# EAGLE design main (EAGLE 9.2.2)

## Sheet 1 of 2
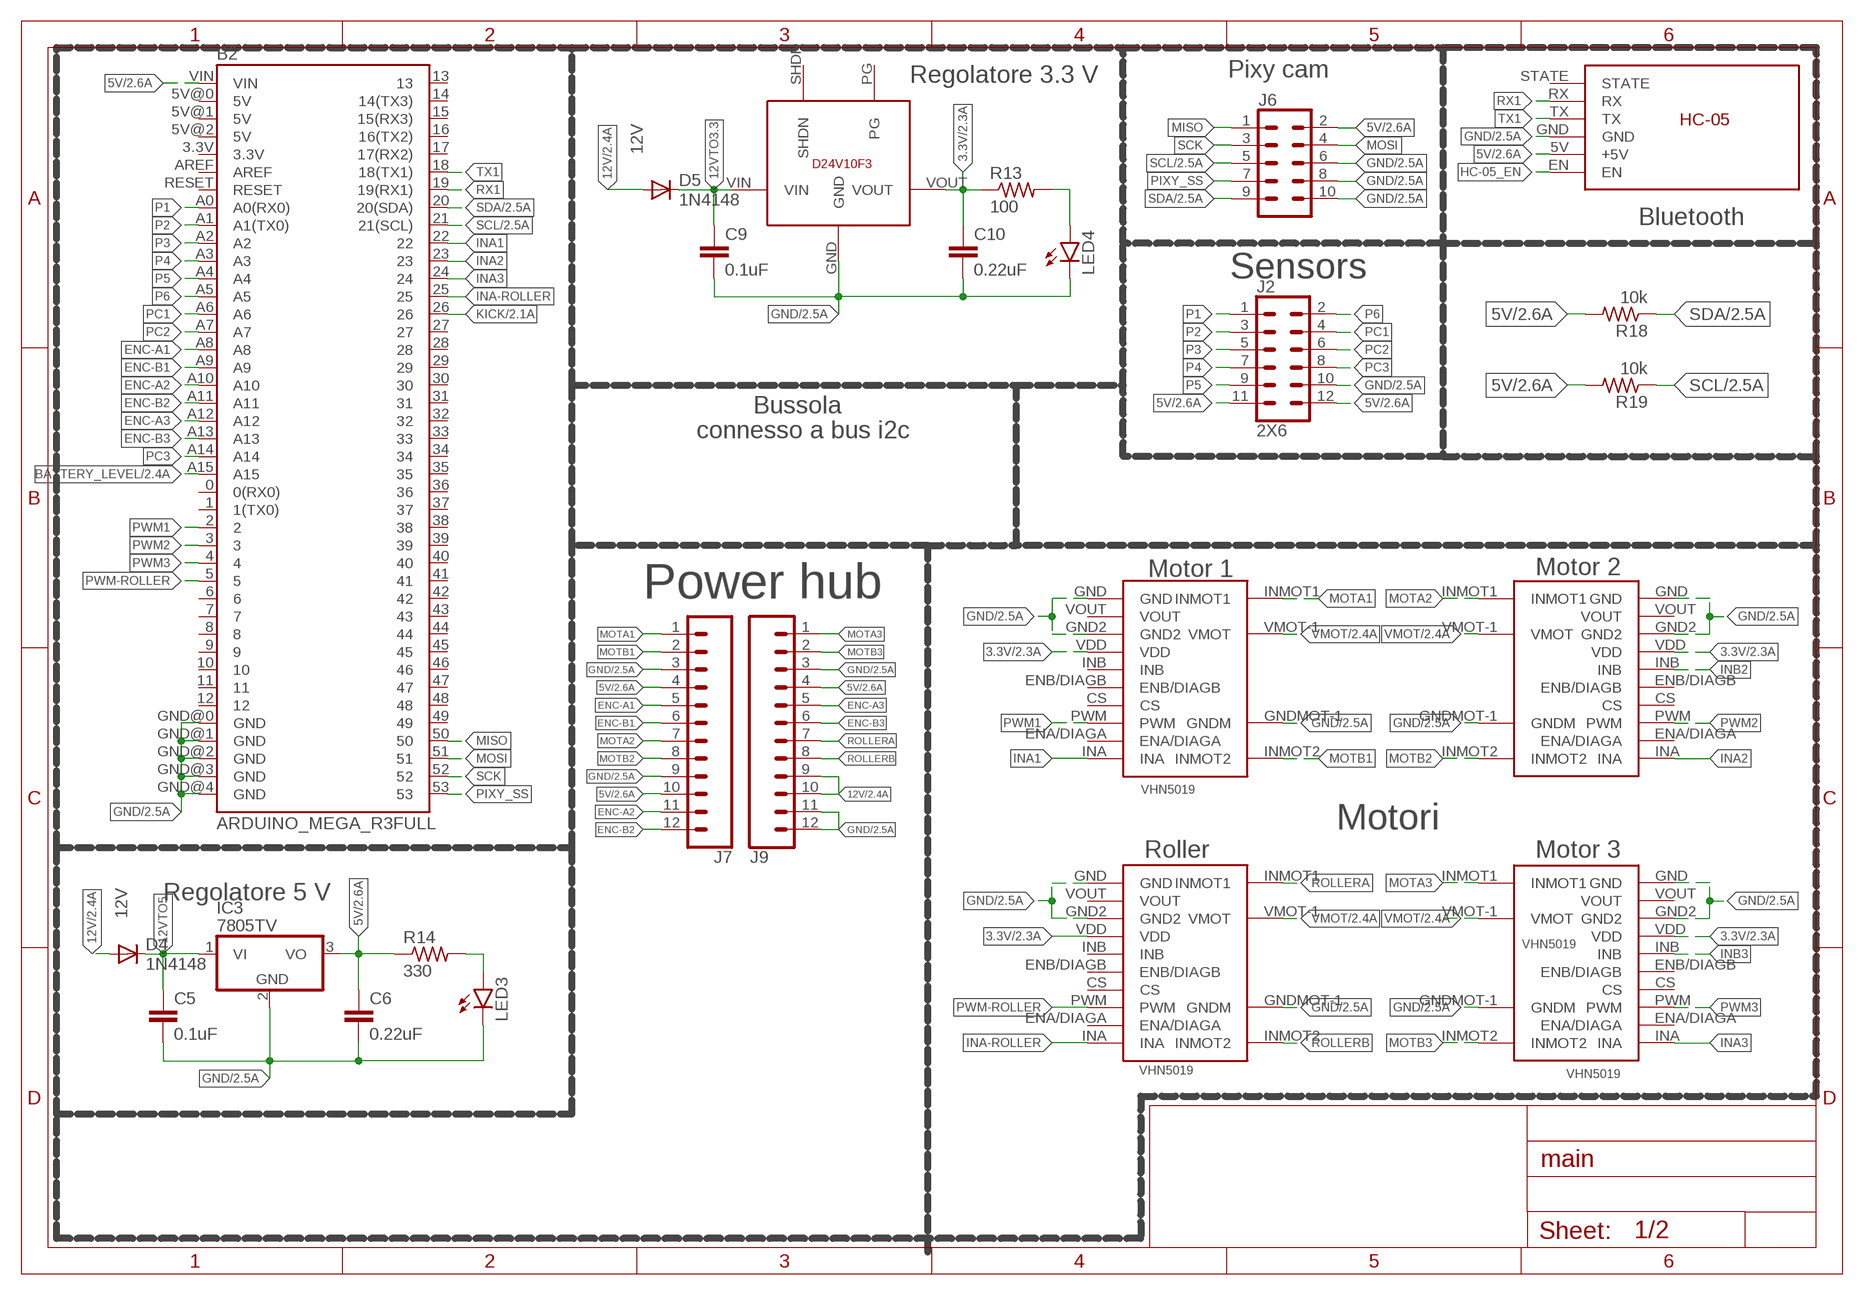
[diagram p0: schematic, sheet 1]

### Parts
B2  ARDUINO_MEGA_R3FULL  [ARDUINO_MEGA]
C5  0.1uF  0.1UF-KIT-EZ-50V-20%  [CAP-PTH-SMALL-KIT]
C6  0.22uF  0.1UF-KIT-EZ-50V-20%  [CAP-PTH-SMALL-KIT]
C9  0.1uF  0.1UF-KIT-EZ-50V-20%  [CAP-PTH-SMALL-KIT]
C10  0.22uF  0.1UF-KIT-EZ-50V-20%  [CAP-PTH-SMALL-KIT]
D4  1N4148  1N4148DO35-7  [DO35-7]
D5  1N4148  1N4148DO35-7  [DO35-7]
IC3  7805TV  [TO220V]
J2  2X6  CONN_06X2PTH_FEMALE  [2X6]
J6  CONN_05X2PTH  [2X5]
J7  CONN_12  [1X12]
J9  CONN_12  [1X12]
LED3  GREEN  LED-GREEN1206  [LED-1206]
LED4  GREEN  LED-GREEN1206  [LED-1206]
R13  100  R-US_M1206  [M1206]
R14  330  R-US_M1206  [M1206]
R18  10k  R-US_M1206  [M1206]
R19  10k  R-US_M1206  [M1206]
U$4  VHN5019  [MOTOR-SHIELD]
U$5  VHN5019  [MOTOR-SHIELD]
U$6  VHN5019  [MOTOR-SHIELD]
U$7  VHN5019  [MOTOR-SHIELD]
U$18  HC-05  [HC-05]
U$19  STEPDOWN_D24V10F3  [STEPDOWN_D24V10F3]

### Nets
3.3V [3v]: C10.1 R13.1 U$4.VDD U$5.VDD U$6.VDD U$7.VDD U$19.VOUT ; also sheet 2
5V [5v]: B2.VIN C6.1 IC3.3(VO) J2.11 J2.12 J6.2 J7.4 J7.10 J9.4 R14.1 R18.2 R19.2 U$18.5V(+5V) ; also sheet 2
12V [12v]: D4.A D5.A J9.9 J9.10 ; also sheet 2
12VTO3.3 [12v]: C9.1 D5.C U$19.VIN
12VTO5 [12v]: C5.1 D4.C IC3.1(VI)
BATTERY_LEVEL: B2.A15 ; also sheet 2
ENC-A1: B2.A8 J7.5
ENC-A2: B2.A10 J7.11
ENC-A3: B2.A12 J9.5
ENC-B1: B2.A9 J7.6
ENC-B2: B2.A11 J7.12
ENC-B3: B2.A13 J9.6
GND [gnd]: B2.GND@0(GND) B2.GND@1(GND) B2.GND@2(GND) B2.GND@3(GND) B2.GND@4(GND) C5.2 C6.2 C9.2 C10.2 IC3.2(GND) J2.10 J6.6 J6.8 J6.10 J7.3 J7.9 J9.3 J9.11 J9.12 LED3.C LED4.C U$4.GND U$4.GND2 U$4.GNDMOT-1(GNDM) U$5.GND U$5.GND2 U$5.GNDMOT-1(GNDM) U$6.GND U$6.GND2 U$6.GNDMOT-1(GNDM) U$7.GND U$7.GND2 U$7.GNDMOT-1(GNDM) U$18.GND U$19.GND ; also sheet 2
HC-05_EN: U$18.EN
INA1: B2.22 U$4.INA
INA2: B2.23 U$5.INA
INA3: B2.24 U$6.INA
INA-ROLLER: B2.25 U$7.INA
INB2: U$5.INB
INB3: U$6.INB
KICK [5v]: B2.26 ; also sheet 2
MISO: B2.50 J6.1
MOSI: B2.51 J6.4
MOTA1 [vmot]: J7.1 U$4.INMOT1
MOTA2 [vmot]: J7.7 U$5.INMOT1
MOTA3 [vmot]: J9.1 U$6.INMOT1
MOTB1 [vmot]: J7.2 U$4.INMOT2
MOTB2 [vmot]: J7.8 U$5.INMOT2
MOTB3 [vmot]: J9.2 U$6.INMOT2
N$1: LED3.A R14.2
N$21: LED4.A R13.2
P1: B2.A0(A0(RX0)) J2.1
P2: B2.A1(A1(TX0)) J2.3
P3: B2.A2 J2.5
P4: B2.A3 J2.7
P5: B2.A4 J2.9
P6: B2.A5 J2.2
PC1: B2.A6 J2.4
PC2: B2.A7 J2.6
PC3: B2.A14 J2.8
PIXY_SS: B2.53 J6.7
PWM1: B2.2 U$4.PWM
PWM2: B2.3 U$5.PWM
PWM3: B2.4 U$6.PWM
PWM-ROLLER: B2.5 U$7.PWM
ROLLERA [vmot]: J9.7 U$7.INMOT1
ROLLERB [vmot]: J9.8 U$7.INMOT2
RX1: B2.19(19(RX1)) U$18.RX
SCK: B2.52 J6.3
SCL: B2.21(21(SCL)) J6.5 R19.1 ; also sheet 2
SDA: B2.20(20(SDA)) J6.9 R18.1 ; also sheet 2
TX1: B2.18(18(TX1)) U$18.TX
VMOT [vmot]: U$4.VMOT-1(VMOT) U$5.VMOT-1(VMOT) U$6.VMOT-1(VMOT) U$7.VMOT-1(VMOT) ; also sheet 2
Unconnected: B2.0(0(RX0)) B2.1(1(TX0)) B2.3.3V B2.5V@0(5V) B2.5V@1(5V) B2.5V@2(5V) B2.6 B2.7 B2.8 B2.9 B2.10 B2.11 B2.12 B2.13 B2.14(14(TX3)) B2.15(15(RX3)) B2.16(16(TX2)) B2.17(17(RX2)) B2.27 B2.28 B2.29 B2.30 B2.31 B2.32 B2.33 B2.34 B2.35 B2.36 B2.37 B2.38 B2.39 B2.40 B2.41 B2.42 B2.43 B2.44 B2.45 B2.46 B2.47 B2.48 B2.49 B2.AREF B2.RESET U$4.CS U$4.ENA/DIAGA U$4.ENB/DIAGB U$4.INB U$4.VOUT U$5.CS U$5.ENA/DIAGA U$5.ENB/DIAGB U$5.VOUT U$6.CS U$6.ENA/DIAGA U$6.ENB/DIAGB U$6.VOUT U$7.CS U$7.ENA/DIAGA U$7.ENB/DIAGB U$7.INB U$7.VOUT U$18.STATE U$19.PG U$19.SHDN

### Notes on the sheet
- Regolatore 3.3 V | Pixy cam
- Bluetooth
- Sensors
- Bussola
- connesso a bus i2c
- Motor 1 | Motor 2
- Power hub
- Motori
- Roller | Motor 3
- Regolatore 5 V

## Sheet 2 of 2
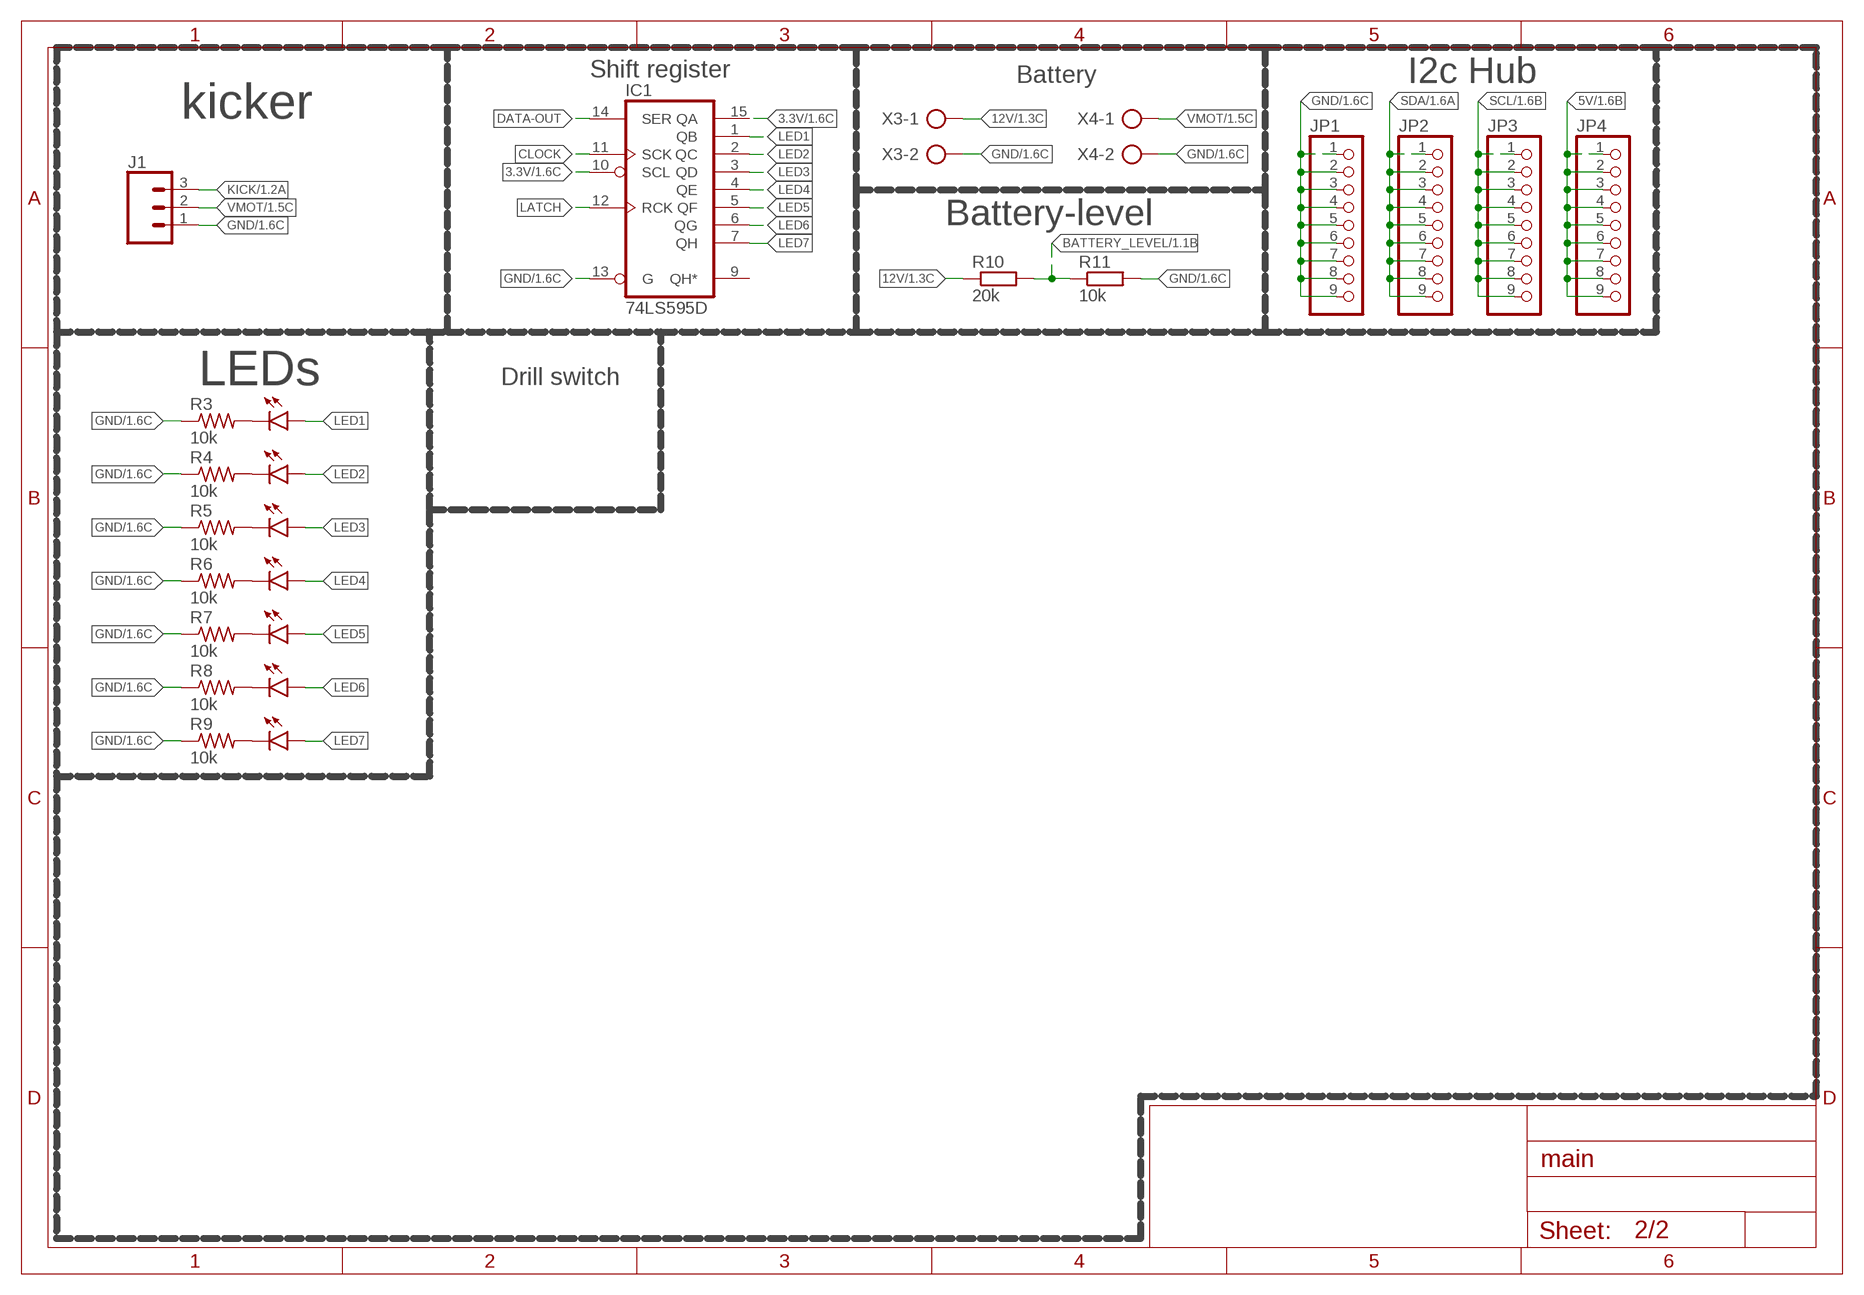
[diagram p1: schematic, sheet 2]

### Parts
D1  GREEN  LED-GREEN1206  [LED-1206]
D3  GREEN  LED-GREEN1206  [LED-1206]
D6  GREEN  LED-GREEN1206  [LED-1206]
D7  GREEN  LED-GREEN1206  [LED-1206]
D8  GREEN  LED-GREEN1206  [LED-1206]
D9  GREEN  LED-GREEN1206  [LED-1206]
D10  GREEN  LED-GREEN1206  [LED-1206]
IC1  74LS595D  [SO16]
J1  CONN_03  [1X03]
JP1  PINHD-1X9  [1X09-BIG]
JP2  PINHD-1X9  [1X09-BIG]
JP3  PINHD-1X9  [1X09-BIG]
JP4  PINHD-1X9  [1X09-BIG]
R3  10k  R-US_M1206  [M1206]
R4  10k  R-US_M1206  [M1206]
R5  10k  R-US_M1206  [M1206]
R6  10k  R-US_M1206  [M1206]
R7  10k  R-US_M1206  [M1206]
R8  10k  R-US_M1206  [M1206]
R9  10k  R-US_M1206  [M1206]
R10  20k  R0204/7  [0204/7]
R11  10k  R0204/7  [0204/7]
X3  AK500/2-H  [AK500/2-H]
X4  AK500/2-H  [AK500/2-H]

### Nets
3.3V [3v]: IC1.10(SCL) IC1.15(QA) ; also sheet 1
5V [5v]: JP4.1 JP4.2 JP4.3 JP4.4 JP4.5 JP4.6 JP4.7 JP4.8 JP4.9 ; also sheet 1
12V [12v]: R10.1 X3.1 ; also sheet 1
BATTERY_LEVEL: R10.2 R11.1 ; also sheet 1
CLOCK: IC1.11(SCK)
DATA-OUT: IC1.14(SER)
GND [gnd]: IC1.13(G) J1.1 JP1.1 JP1.2 JP1.3 JP1.4 JP1.5 JP1.6 JP1.7 JP1.8 JP1.9 R3.1 R4.1 R5.1 R6.1 R7.1 R8.1 R9.1 R11.2 X3.2 X4.2 ; also sheet 1
KICK [5v]: J1.3 ; also sheet 1
LATCH: IC1.12(RCK)
LED1: D1.A IC1.1(QB)
LED2: D3.A IC1.2(QC)
LED3: D6.A IC1.3(QD)
LED4: D7.A IC1.4(QE)
LED5: D8.A IC1.5(QF)
LED6: D9.A IC1.6(QG)
LED7: D10.A IC1.7(QH)
N$2: D1.C R3.2
N$3: D3.C R4.2
N$4: D6.C R5.2
N$5: D7.C R6.2
N$6: D8.C R7.2
N$7: D9.C R8.2
N$8: D10.C R9.2
SCL: JP3.1 JP3.2 JP3.3 JP3.4 JP3.5 JP3.6 JP3.7 JP3.8 JP3.9 ; also sheet 1
SDA: JP2.1 JP2.2 JP2.3 JP2.4 JP2.5 JP2.6 JP2.7 JP2.8 JP2.9 ; also sheet 1
VMOT [vmot]: J1.2 X4.1 ; also sheet 1
Unconnected: IC1.9(QH*)

### Notes on the sheet
- Shift register | Battery | I2c Hub
- kicker
- Battery-level
- LEDs | Drill switch

## Power pins joined to a net without a drawn wire
GND: IC1.8(GND)
VCC: IC1.16(VCC)

## Library data of the parts
B2 = SparkFun-Boards:ARDUINO_MEGA_R3: Arduino Mega R3 ATmega2560 R3 compatible footprint. SparkFun Products: Arduino Mega 2560 R3 <https://www.sparkfun.com/products/11061>
C5 C9 = SparkFun-Capacitors:0.1UF: 0.1µF ceramic capacitors A capacitor is a passive two-terminal electrical component used to store electrical energy temporarily in an electric field.; PROD_ID: CAP-08370
C6 C10 = SparkFun-Capacitors:0.1UF: 0.1µF ceramic capacitors A capacitor is a passive two-terminal electrical component used to store electrical energy temporarily in an electric field.; PROD_ID: CAP-08370; VALUE: 0.1uF
D1 D3 D6-D10 LED3 LED4 = SparkFun-LED:LED-GREEN: Green SMD LED Used in manufacturing of various products at SparkFun Packages: 0603 - SMD 0603 package [Product Link] <http://www.futureelectronics.com/en/technologies/semiconductors/optoelectronics/leds/Pages/9894312-LTST-C190GKT.aspx?CrossPart=HSMG-C190&IM=0> LilyPad 1206 - SMD1206 LilyPad package [Product Link] <http://www.futureelectronics.com/en/Technologies/Product.aspx?ProductID=IN150NGHARVATEKCORPORATION2049943&IM=0> 1206 - SMD1206 package [Product Link] <http://www.futureelectronics.com/en/technologies/semiconductors/optoelectronics/leds/Pages/8315665-LTST-C150KGKT.aspx?IM=0> 1206 Bottom Mount -SMD 1206 Bottom Mount [Product Link] <http://www.digikey.com/product-detail/en/lite-on-inc/LTST-C230KGKT/160-1456-1-ND/386854> SparkFun Products: Pro Mini 328 -5V <https://www.sparkfun.com/products/821> RedBoard <https://www.sparkfun.com/products/12757> MP3 Trigger <https://www.sparkfun.com/products/13720> Makey Makey <https://www.sparkfun.com/products/11076>; PROD_ID: DIO-00862
D4 D5 = diode:1N4148: DIODE high speed (Philips)
IC1 = 74xx-us:74*595: 8-bit SHIFT REGISTER, output latch
IC3 = linear:78*: Positive VOLTAGE REGULATOR Source: http://cache.national.com/ds/LM/LM78L05.pdf http://www.fairchildsemi.com/ds/LM/LM7805.pdf
J1 = SparkFun-Connectors:CONN_03: Multi connection point. Often used as Generic Header-pin footprint for 0.1 inch spaced/style header connections On any of the 0.1 inch spaced packages, you can populate with these: Break Away Headers - Straight <https://www.sparkfun.com/products/116> (PRT-00116) Break Away Male Headers - Right Angle <https://www.sparkfun.com/products/553> (PRT-00553) Female Headers <https://www.sparkfun.com/products/115> (PRT-00115) Break Away Headers - Machine Pin <https://www.sparkfun.com/products/117> (PRT-00117) Break Away Female Headers - Swiss Machine Pin <https://www.sparkfun.com/products/743> (PRT-00743) Stackable Header - 3 Pin (Female, 0.1") <https://www.sparkfun.com/products/13875> (PRT-13875) For SCREWTERMINALS and SPRING TERMINALS visit here: Screw Terimnals on SparkFun.com <https://www.sparkfun.com/search/results?term=Screw+Terminals> (5mm/3.5mm/2.54mm spacing) This device is also useful as a general connection point to wire up your design to another part of your project. Our various solder wires solder well into these plated through hole pads. Hook-Up Wire - Assortment (Stranded, 22 AWG) <https://www.sparkfun.com/products/11375> (PRT-11375) Hook-Up Wire - Assortment (Solid Core, 22 AWG) <https://www.sparkfun.com/products/11367> (PRT-11367) View the entire wire category on our website here <https://www.sparkfun.com/categories/141> Special notes: Molex polarized connector foot print use with SKU : PRT-08232 with associated crimp pins and housings.
J2 = SparkFun-Connectors:CONN_06X2: Multi connection point. Often used as Generic Header-pin footprint for 0.1 inch spaced/style header connections On any of the 0.1 inch spaced packages, you can populate with these: Break Away Headers - Straight <https://www.sparkfun.com/products/116> (PRT-00116) Break Away Male Headers - Right Angle <https://www.sparkfun.com/products/553> (PRT-00553) Female Headers <https://www.sparkfun.com/products/115> (PRT-00115) Break Away Headers - Machine Pin <https://www.sparkfun.com/products/117> (PRT-00117) Break Away Female Headers - Swiss Machine Pin <https://www.sparkfun.com/products/743> (PRT-00743); PROD_ID: CONN-12423; VALUE: 2X6 FEMALE
J6 = SparkFun-Connectors:CONN_05X2: Multi connection point. Often used as Generic Header-pin footprint for 0.1 inch spaced/style header connections For AVR SPI programming port, see special device with nice symbol: "AVR_SPI_PROG_5x2.dev" You can populate with any combo of single row headers, but if you'd like an exact match, check these: 2x5 AVR ICSP Male Header <https://www.sparkfun.com/products/778> (PRT-00778) 2x5 Pin Shrouded Header <https://www.sparkfun.com/products/8506> (PRT-08506) On any of the 0.1 inch spaced packages, you can populate with these: Break Away Headers - Straight <https://www.sparkfun.com/products/116> (PRT-00116) Break Away Male Headers - Right Angle <https://www.sparkfun.com/products/553> (PRT-00553) Female Headers <https://www.sparkfun.com/products/115> (PRT-00115) Break Away Headers - Machine Pin <https://www.sparkfun.com/products/117> (PRT-00117) Break Away Female Headers - Swiss Machine Pin <https://www.sparkfun.com/products/743> (PRT-00743) Special note: the shrouded connector mates well with our 5x2 ribbon cables: 2x5 Pin IDC Ribbon Cable <https://www.sparkfun.com/products/8535> (PRT-08535); PROD_ID: CONN-08499; SF_ID: PRT-0778
J7 J9 = SparkFun-Connectors:CONN_12: Multi connection point. Often used as Generic Header-pin footprint for 0.1 inch spaced/style header connections On any of the 0.1 inch spaced packages, you can populate with these: Break Away Headers - Straight <https://www.sparkfun.com/products/116> (PRT-00116) Break Away Male Headers - Right Angle <https://www.sparkfun.com/products/553> (PRT-00553) Female Headers <https://www.sparkfun.com/products/115> (PRT-00115) Break Away Headers - Machine Pin <https://www.sparkfun.com/products/117> (PRT-00117) Break Away Female Headers - Swiss Machine Pin <https://www.sparkfun.com/products/743> (PRT-00743) For SCREWTERMINALS and SPRING TERMINALS visit here: Screw Terimnals on SparkFun.com <https://www.sparkfun.com/search/results?term=Screw+Terminals> (5mm/3.5mm/2.54mm spacing) This device is also useful as a general connection point to wire up your design to another part of your project. Our various solder wires solder well into these plated through hole pads. Hook-Up Wire - Assortment (Stranded, 22 AWG) <https://www.sparkfun.com/products/11375> (PRT-11375) Hook-Up Wire - Assortment (Solid Core, 22 AWG) <https://www.sparkfun.com/products/11367> (PRT-11367) View the entire wire category on our website here <https://www.sparkfun.com/categories/141> Special notes: Molex polarized connector foot print use with SKU : PRT-08231 with associated crimp pins and housings. 1MM SMD Version SKU: PRT-10208 NOTES ON THE VARIANTS LOCK and LOCK_LONGPADS... This footprint was designed to help hold the alignment of a through-hole component (i.e. 6-pin header) while soldering it into place. You may notice that each hole has been shifted either up or down by 0.005 of an inch from it's more standard position (which is a perfectly straight line). This slight alteration caused the pins (the squares in the middle) to touch the edges of the holes. Because they are alternating, it causes a "brace" to hold the component in place. 0.005 has proven to be the perfect amount of "off-center" position when using our standard breakaway headers. Although looks a little odd when you look at the bare footprint, once you have a header in there, the alteration is very hard to notice. Also,if you push a header all the way into place, it is covered up entirely on the bottom side.
JP1-JP4 = adafruit:PINHD-1X9: Pin header 1x10 0.1" spacing With round pins
R3-R9 R13 R14 R18 R19 = resistor:R-US_: RESISTOR, American symbol
R10 R11 = eagle-ltspice:R: RESISTOR, European symbol; SPICEMODEL: NONE; SPICEPREFIX: R
U$4-U$7 = VHN5019:VHN5019: Operating voltage: 5.5 – 24 V1 Output current: 12 A continuous (30 maximum) 3V-compatible inputs PWM operation up to 20 kHz, which is ultrasonic and allows for quieter motor operation Current sense output proportional to motor current (approx. 140 mV/A) Motor indicator LEDs (indicates what the outputs are doing even when no motor is connected) Robust: Reverse-voltage protection Can survive input voltages up to 41 V Undervoltage and overvoltage shutdown High-side and low-side thermal shutdown Short-to-ground and short-to-Vcc protection; MOTOR: motor
U$18 = HC-05:HC-05
U$19 = StepDown_ 3.3V_D24V10F3:STEPDOWN_D24V10F3: Step down pololu D24V10F3 da 12 V a 3.3V
X3 X4 = con-ptr500:AK500/2-H: CONNECTOR Aug. 2004 / PTR Meßtechnik: Die Bezeichnung der Serie AK505 wurde geändert. Es handelt sich hierbei um AK500 in horizontaler Ausführung.; OC_FARNELL: unknown; OC_NEWARK: unknown

## Net classes
0 default: width 0.508 mm, clearance 0.152 mm
1 gnd: width 1.27 mm, clearance 0.152 mm
2 12v: width 1.524 mm, clearance 0.406 mm
3 5v: width 0.508 mm, clearance 0.305 mm
4 3v: width 0.508 mm, clearance 0.305 mm
5 vmot: width 1.27 mm, clearance 0.406 mm

## Board
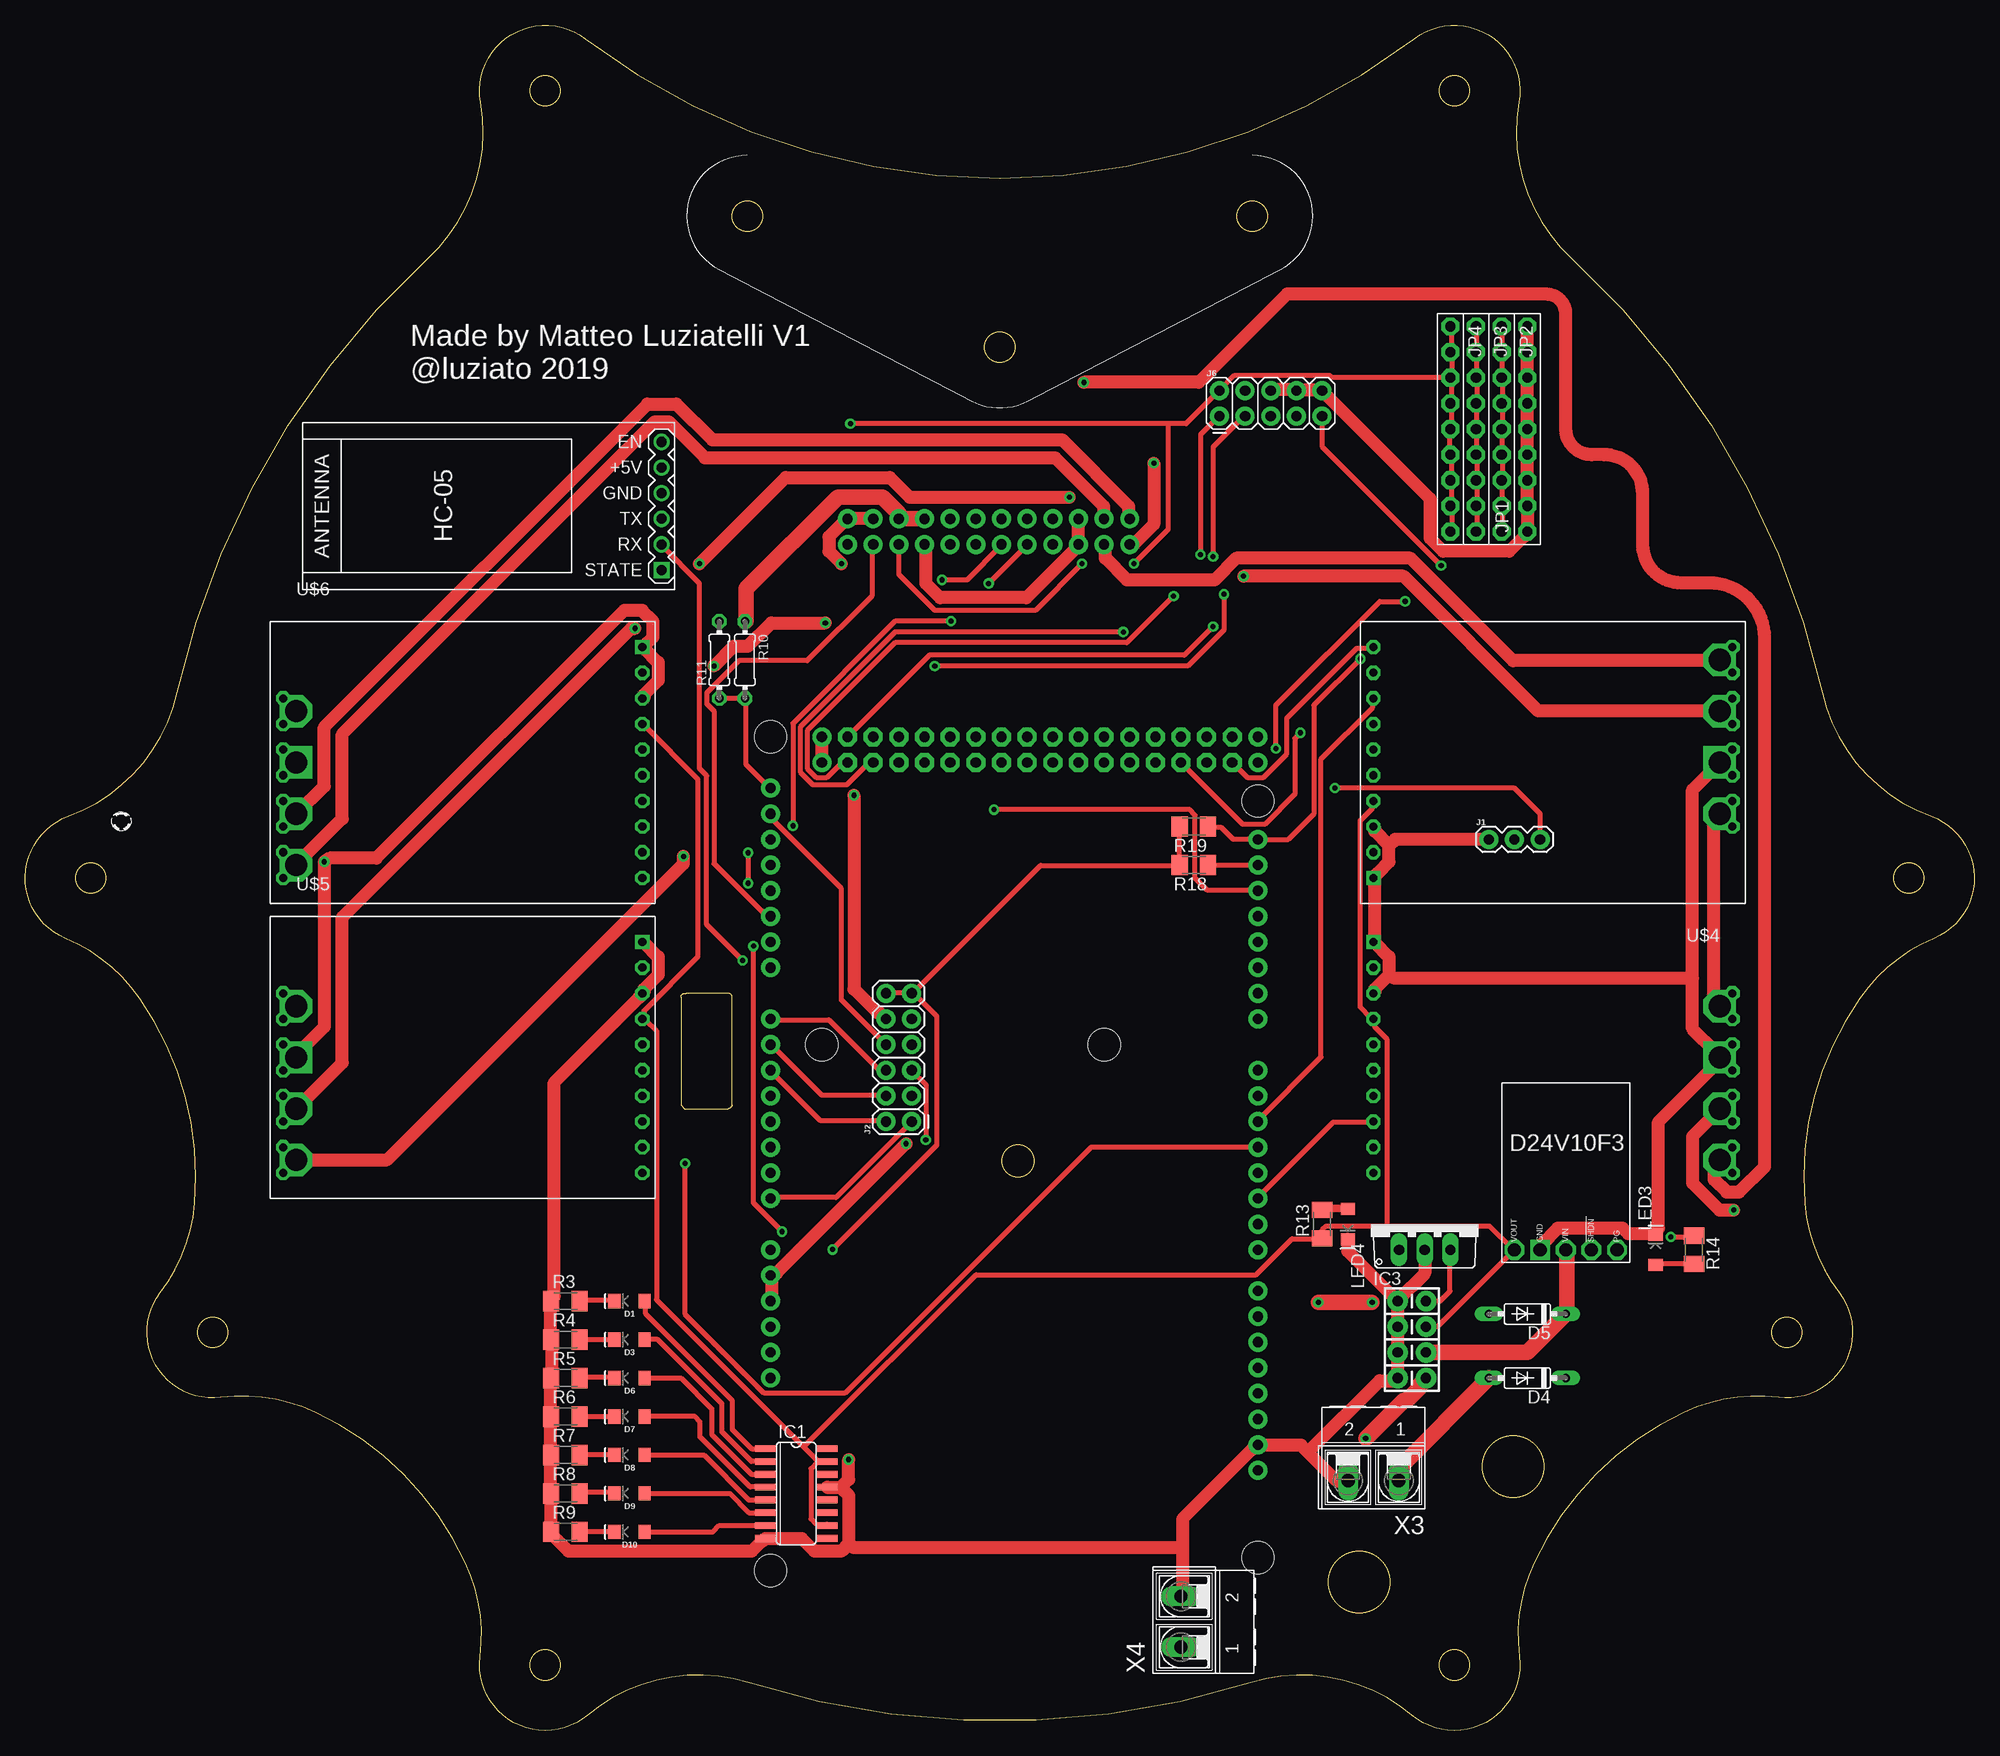
[diagram p2: board, top side]
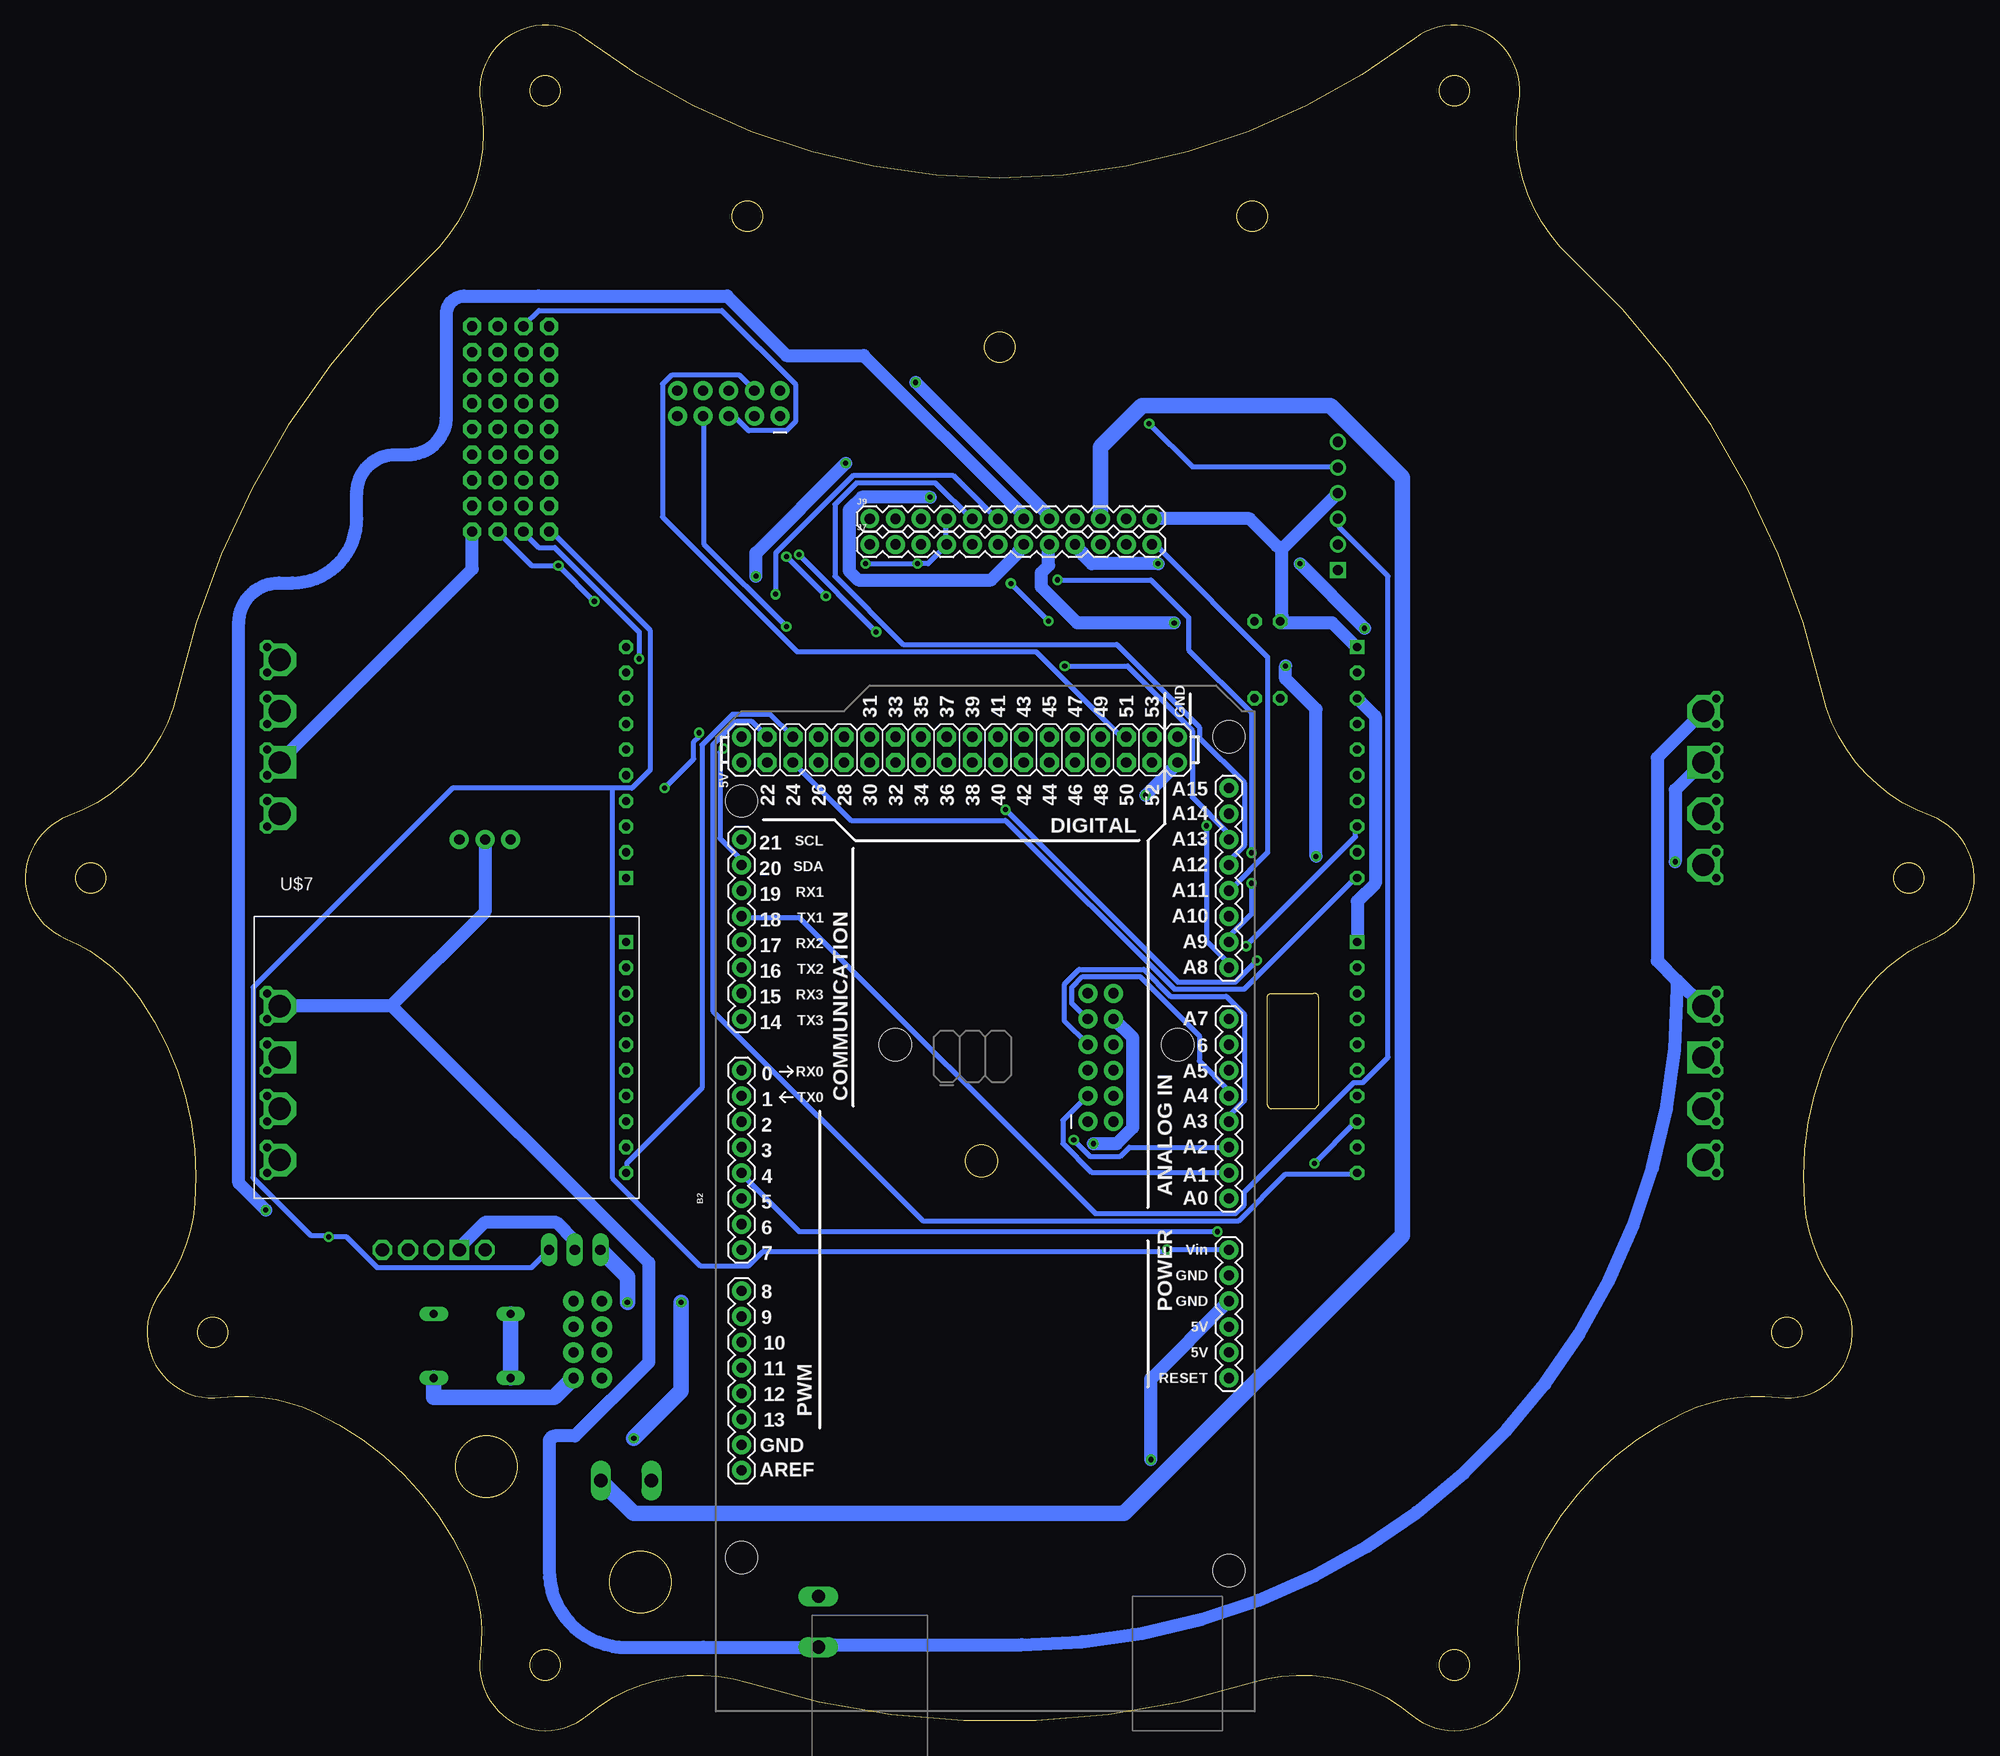
[diagram p3: board, bottom side, seen from below]

Size 193 x 168.88 mm. Coordinates in mm from the lower left corner, seen from the top.
Outline: 15.04,102.79 arc-35 39.88,145.82 arc57 45.1,161.26 arc-137 55.43,167.56 arc74 137.57,167.56 arc-137 147.9,161.26 arc57 153.12,145.82 arc-35 177.96,102.79 arc57 188.72,90.55 arc-137 189.01,78.45 arc32 181.65,72.5 arc40 176.22,52.2 arc32 179.62,43.37 arc-134 173.62,32.99 arc32 164.28,31.53 arc40 149.42,16.66 arc32 147.95,7.32 arc-137 137.32,1.52 arc57 121.34,4.72 arc-35 71.66,4.72 arc57 55.68,1.52 arc-137 45.05,7.32 arc32 43.58,16.66 arc40 28.72,31.53 arc32 19.37,32.99 arc-134 13.38,43.37 arc32 16.78,52.2 arc40 11.34,72.5 arc32 3.98,78.45 arc-137 4.27,90.55 arc57 15.04,102.79
Outline: 66.19,61.58 69.62,61.58 arc67 70,61.96 70,72.63 arc90 69.62,73.01 69.49,73.01 65.43,73.01 65.3,73.01 arc90 64.92,72.63 64.92,62.85 64.92,61.96 65.3,61.58 66.19,61.58
Outline: circle at 96.5,136.99 radius 1.5
Outline: circle at 6.5,84.44 radius 1.5
Outline: circle at 121.5,149.99 radius 1.5
Outline: circle at 18.56,39.44 radius 1.5
Outline: circle at 141.5,6.5 radius 1.5
Outline: circle at 141.5,162.38 radius 1.5
Outline: circle at 186.5,84.44 radius 1.5
Outline: circle at 51.5,162.38 radius 1.5
Outline: circle at 51.5,6.5 radius 1.5
Outline: circle at 174.44,39.44 radius 1.5
Outline: circle at 71.5,149.99 radius 1.5
Outline: circle at 147.34,26.15 radius 3.05
Outline: circle at 132.1,14.72 radius 3.05
Outline: circle at 98.31,56.43 radius 1.6
Copper layers (1*16): Top 0.035mm / dielectric 1.5mm / Bottom 0.035mm
Design rules "SparkFun": minimum track width 8mil, minimum drill 20mil, track to track 8mil, track to pad 8mil, pad to pad 8mil, via to via 8mil, smd to smd 8mil, copper to edge 10mil, drill to drill 8mil, minimum pad ring 12mil, minimum via ring 10mil, stop-mask expansion 4mil, vias tented up to drill 25mil, thermal gap 10mil

### Footprints (pad centres in the part's own frame; a part is rotated, then mirrored left to right if it is on the bottom)
ARDUINO_MEGA = drill 1.016 pad 1.88: 0 13.97,24.13; 1 11.43,24.13; 2 8.89,24.13; 3 6.35,24.13; 3.3V -13.97,-24.13; 4 3.81,24.13; 5 1.27,24.13; 5V@0 -11.43,-24.13; 5V@1 44.45,24.13; 5V@2 46.99,24.13; 6 -1.27,24.13; 7 -3.81,24.13; 8 -7.874,24.13; 9 -10.414,24.13; 10 -12.954,24.13; 11 -15.494,24.13; 12 -18.034,24.13; 13 -20.574,24.13; 14 19.05,24.13; 15 21.59,24.13; 16 24.13,24.13; 17 26.67,24.13; 18 29.21,24.13; 19 31.75,24.13; 20 34.29,24.13; 21 36.83,24.13; A0 1.27,-24.13; A1 3.81,-24.13; A2 6.35,-24.13; A3 8.89,-24.13; A4 11.43,-24.13; A5 13.97,-24.13; A6 16.51,-24.13; A7 19.05,-24.13; A8 24.13,-24.13; A9 26.67,-24.13; A10 29.21,-24.13; A11 31.75,-24.13; A12 34.29,-24.13; A13 36.83,-24.13; A14 39.37,-24.13; A15 41.91,-24.13; AREF -25.654,24.13; GND@0 -8.89,-24.13; GND@1 -6.35,-24.13; GND@2 44.45,-19.05; GND@3 46.99,-19.05; GND@4 -23.114,24.13; RESET -16.51,-24.13; VIN -3.81,-24.13 | drill 1.016 pad 1.88 octagon: 22 44.45,21.59; 23 46.99,21.59; 24 44.45,19.05; 25 46.99,19.05; 26 44.45,16.51; 27 46.99,16.51; 28 44.45,13.97; 29 46.99,13.97; 30 44.45,11.43; 31 46.99,11.43; 32 44.45,8.89; 33 46.99,8.89; 34 44.45,6.35; 35 46.99,6.35; 36 44.45,3.81; 37 46.99,3.81; 38 44.45,1.27; 39 46.99,1.27; 40 44.45,-1.27; 41 46.99,-1.27; 42 44.45,-3.81; 43 46.99,-3.81; 44 44.45,-6.35; 45 46.99,-6.35; 46 44.45,-8.89; 47 46.99,-8.89; 48 44.45,-11.43; 49 46.99,-11.43; 50 44.45,-13.97; 51 46.99,-13.97; 52 44.45,-16.51; 53 46.99,-16.51 | hole 3.2: -34.29,24.13; -35.56,-24.13; 16.51,8.89; 16.51,-19.05; 40.64,24.13; 46.99,-24.13
CAP-PTH-SMALL-KIT = drill 1.016 pad 2.032: 1 -1.397,0; 2 1.397,0
LED-1206 = smd 1.2 x 1.4: A -1.5,0; C 1.5,0
DO35-7 = drill 0.813 long: A 3.81,0; C -3.81,0
SO16 = smd 0.66 x 2.032: 1 -4.445,-3.073; 2 -3.175,-3.073; 3 -1.905,-3.073; 4 -0.635,-3.073; 5 0.635,-3.073; 6 1.905,-3.073; 7 3.175,-3.073; 8 4.445,-3.073; 9 4.445,3.073; 10 3.175,3.073; 11 1.905,3.073; 12 0.635,3.073; 13 -0.635,3.073; 14 -1.905,3.073; 15 -3.175,3.073; 16 -4.445,3.073
TO220V = drill 1.016 long: 1 -2.54,-2.54; 2 0,-2.54; 3 2.54,-2.54
1X03 = drill 1.016 pad 1.88: 1 0,0; 2 2.54,0; 3 5.08,0
2X6 = drill 1.016 pad 1.88: 1 0,0; 2 0,2.54; 3 2.54,0; 4 2.54,2.54; 5 5.08,0; 6 5.08,2.54; 7 7.62,0; 8 7.62,2.54; 9 10.16,0; 10 10.16,2.54; 11 12.7,0; 12 12.7,2.54
2X5 = drill 1.016 pad 1.88: 1 0,0; 2 0,2.54; 3 2.54,0; 4 2.54,2.54; 5 5.08,0; 6 5.08,2.54; 7 7.62,0; 8 7.62,2.54; 9 10.16,0; 10 10.16,2.54
1X12 = drill 1.016 pad 1.88: 1 0,0; 2 2.54,0; 3 5.08,0; 4 7.62,0; 5 10.16,0; 6 12.7,0; 7 15.24,0; 8 17.78,0; 9 20.32,0; 10 22.86,0; 11 25.4,0; 12 27.94,0
1X09-BIG = drill 1.016 pad 1.778 octagon: 1 -10.16,0; 2 -7.62,0; 3 -5.08,0; 4 -2.54,0; 5 0,0; 6 2.54,0; 7 5.08,0; 8 7.62,0; 9 10.16,0
M1206 = smd 1.6 x 2: 1 -1.4,0; 2 1.4,0
0204/7 = drill 0.813 octagon: 1 -3.81,0; 2 3.81,0
MOTOR-SHIELD = drill 0.8 octagon: CS 29.21,-5.08; ENA/DIAGA 29.21,-10.16; ENB/DIAGB 29.21,-2.54; GND2 29.21,5.08; GNDMOT-2 -6.35,0; GNDMOT-3 -6.35,-2.54; INA 29.21,-12.7; INB 29.21,0; OUTA-2 -6.35,-10.16; OUTA-3 -6.35,-12.7; OUTB-2 -6.35,-5.08; OUTB-3 -6.35,-7.62; PWM 29.21,-7.62; VDD 29.21,2.54; VMOT-2 -6.35,5.08; VMOT-3 -6.35,2.54; VOUT 29.21,7.62 | drill 0.8 square: GND 29.21,10.16 | drill 2.2 square: GNDMOT-1 -5.08,-1.27 | drill 2.2 octagon: INMOT1 -5.08,-6.35; INMOT2 -5.08,-11.43; VMOT-1 -5.08,3.81
HC-05 = drill 1: 5V 3.81,-19.685; EN 6.35,-19.685; GND 1.27,-19.685; RX -3.81,-19.685; TX -1.27,-19.685 | drill 1 square: STATE -6.35,-19.685
STEPDOWN_D24V10F3 = drill 1.3 square: GND -2.54,-7.62 | drill 1.3 octagon: PG 5.08,-7.62; SHDN 2.54,-7.62; VIN 0,-7.62; VOUT -5.08,-7.62
AK500/2-H = drill 1.321 long: 1 -2.515,0; 2 2.515,0

### Placement (x,y rotation side)
B2  97.94,51.42 90 bottom
C5  137.31,34.91 180 top
C6  137.31,42.53 180 top
C9  137.31,37.45 180 top
C10  137.31,39.99 180 top
D1  59.84,42.53 180 top
D3  59.84,38.72 180 top
D4  148.74,34.91 180 top
D5  148.74,41.26 180 top
D6  59.84,34.91 180 top
D7  59.84,31.1 180 top
D8  59.84,27.29 180 top
D9  59.84,23.48 180 top
D10  59.84,19.67 180 top
IC1  76.35,23.48 270 top
IC3  138.58,50.15 0 top
J1  144.93,88.25 0 top
J2  87.78,60.31 90 top
J6  118.26,130.16 0 top
J7  109.37,117.46 0 bottom
J9  109.37,120 0 bottom
JP1  148.74,128.89 90 top
JP2  146.2,128.89 270 top
JP3  143.66,128.89 270 top
JP4  141.12,128.89 270 top
LED3  161.44,47.61 90 top
LED4  130.96,50.15 270 top
R3  53.49,42.53 0 top
R4  53.49,38.72 0 top
R5  53.49,34.91 0 top
R6  53.49,31.1 0 top
R7  53.49,27.29 0 top
R8  53.49,23.48 0 top
R9  53.49,19.67 0 top
R10  71.27,106.03 270 top
R11  68.73,106.03 90 top
R13  128.42,50.15 90 top
R14  165.25,47.61 270 top
R18  115.72,85.71 180 top
R19  115.72,89.52 180 top
U$4  162.71,94.6 180 top
U$5  31.9,67.93 0 top
U$6  31.9,97.14 0 top
U$7  162.71,67.93 0 bottom
U$18  43.33,121.27 90 top
U$19  152.55,55.23 0 top
X3  133.5,24.75 180 top
X4  114.45,10.78 90 top

### Tracks (layer width: path | path; a pad name or v marks a point on that pad's centre or on a via)
3.3V
  Top 0.508: 134.87,49.95 145,49.95 147.32,47.64 U$19.VOUT 139.85,39.99 C10.1 | 134.87,49.95 128.8,49.95 128.42,49.57 R13.1 128.29,48.7 125.45,48.7 121.89,45.15 94.15,45.15 77.09,28.08 | 134.87,49.95 134.87,68.44 133.63,69.69 133.63,70.4 U$7.VDD 133.27,70.57 132.2,71.64 132.2,90.13 133.45,91.38 133.45,91.91 U$4.VDD | 78.51,26.66 77.8,25.95 77.8,20.97 78.33,20.43 79.4,20.43 IC1.10 | IC1.15 78.51,26.66 | U$6.VDD 61.26,99.56 66.59,94.22 66.59,76.62 61.26,71.29 61.26,70.57 U$5.VDD 61.44,70.4 62.51,69.33 62.51,42.66 77.09,28.08 | 77.09,28.08 78.51,26.66
5V  (via drill 0.51)
  Top 0.508: R19.2 114.25,89.42 114.25,85.86 R18.2 114.07,85.69 100.55,85.69 87.93,73.06 J2.11 | v79.93,47.64 90.24,57.95 90.24,70.75 88.11,72.89 J2.11 | J2.12 85.26,73.06 87.58,73.06 J2.11 | v162.96,48.88 165.1,48.88 R14.1 | J7.10 86.51,114.49 90.06,110.93 100.02,110.93 v104.64,115.56 | JP4.3 141.27,134.05 141.27,136.36 JP4.2 141.27,136.72 141.27,139.03 JP4.1 | JP4.9 141.27,118.76 141.27,121.25 JP4.8 141.27,121.42 141.27,123.74 JP4.7 141.27,123.91 141.27,126.23 JP4.6 141.09,126.58 141.09,128.89 JP4.5 141.27,129.07 141.27,131.38 JP4.4 141.27,131.56 141.27,133.87 JP4.3 | 113.18,129.43 114.96,129.43 118.16,132.63 J6.2 118.33,132.8 119.76,134.23 129.18,134.23 129.36,134.05 140.92,134.05 JP4.3 | 113.18,129.43 v81.71,129.43 | v109.8,115.56 113.18,118.94 113.18,129.43 | IC3.3 141.09,47.59 141.09,43.5 140.13,42.53 C6.1
  Bottom 0.508: B2.VIN 73.88,47.64 v79.93,47.64 80.11,47.46 119.93,47.46 121.36,46.04 126.16,46.04 134.87,54.75 134.87,93.33 | J9.4 101.8,120 101.8,117.69 J7.4 101.8,117.34 103.58,115.56 v104.64,115.56 v109.8,115.56 | v81.71,129.43 77.44,125.16 63.04,125.16 U$18.5V | 134.87,93.33 132.91,93.33 131.14,95.11 131.14,108.98 140.74,118.58 141.09,118.58 JP4.9 | 134.87,93.33 150.69,93.33 170.43,73.6 170.43,54.75 164.74,49.06 163.14,49.06 v162.96,48.88 161.18,48.88 158.16,45.86 142.87,45.86 IC3.3
12V
  Top 1.524: R10.1 71.4,109.87 71.4,113.07 80.46,122.14 84.91,122.14 86.51,120.54 J9.10 J9.9 | X3.1 136.01,26 D4.A
  Bottom 1.524: J9.10 86.51,127.11 82.42,131.2 63.75,131.2 56.64,124.09 56.64,49.06 84.2,21.5 132.76,21.5 X3.1 | D4.A D5.A
12VTO3.3
  Top 1.524: U$19.VIN 152.65,47.46 152.65,41.95 D5.C 148.74,37.45 C9.1
12VTO5  (via drill 0.51)
  Top 1.524: C5.1 138.1,34.3 138.1,34.01 136.82,32.73 136.52,32.73 v132.74,28.94 | v128.04,42.41 v133.37,42.41
  Bottom 1.524: D4.C 152.55,32.98 140.64,32.98 C5.1 | v132.74,28.94 128.04,33.64 v128.04,42.41 | v133.37,42.41 133.37,44.95 IC3.1
BATTERY_LEVEL
  Top 0.508: R11.1 R10.2 71.4,102.04 71.4,95.64 73.71,93.33 B2.A15
ENC-A1  (via drill 0.51)
  Top 0.508: v76.02,89.6 76.02,99.73 86.15,109.87 v91.66,109.87 | v95.4,113.6 99.13,117.34 J7.5
  Bottom 0.508: v76.02,89.6 76.02,78.22 73.88,76.09 73.88,75.55 B2.A8 | v95.4,113.6 v91.66,109.87
ENC-A2
  Top 0.508: B2.A10 73.71,80.71 73.35,80.71 68.2,85.86 68.2,100.98 67.48,101.69 67.48,102.76 70.68,105.96 77.44,105.96 83.84,112.36 83.84,117.34 J7.11
ENC-A3
  Bottom 0.508: B2.A12 73.71,85.86 73.71,86.22 72.28,87.64 72.28,93.87 76.73,98.31 76.73,99.38 84.91,107.56 106.07,107.56 112.82,114.31 112.82,121.42 110.69,123.56 102.87,123.56 99.31,120 J9.5
ENC-B1  (via drill 0.51)
  Top 0.508: v71.57,86.93 v71.57,83.91 | v90.78,113.96 93.26,113.96 96.64,117.34 J7.6
  Bottom 0.508: v71.57,83.91 71.57,80.89 73.71,78.75 73.71,78.22 B2.A9 | v71.57,86.93 71.57,100.8 77.8,107.02 77.8,110.22 81.53,113.96 v90.78,113.96
ENC-B2
  Bottom 0.508: B2.A11 73.71,83.2 69.97,86.93 69.97,106.31 81,117.34 81.35,117.34 J7.12
ENC-B3  (via drill 0.51)
  Top 0.508: v90.06,105.42 115.13,105.42 118.69,108.98 v118.69,112.53
  Bottom 0.508: v90.06,105.42 83.84,105.42 77.44,99.02 77.44,92.44 73.88,88.89 73.88,88.35 B2.A13 | v118.69,112.53 118.69,116.62 111.04,124.27 101.09,124.27 96.82,120 J9.6
GND  (via drill 0.51)
  Top 1.27: U$5.GNDMOT-1 26.95,66.66 26.95,67.02 29.61,69.69 v29.61,86.04 30.15,86.4 34.77,86.4 59.31,110.93 61.08,110.93 62.15,109.87 62.15,108.27 61.62,107.73 U$6.GND 61.26,107.2 62.68,105.78 62.68,104 61.26,102.58 61.26,102.22 U$6.GND2 | J7.9 89.18,117.34 89.18,113.6 90.6,112.18 99.13,112.18 104.29,117.34 J7.3 J9.3 | J9.11 J9.12 81,119.65 79.57,118.22 79.57,116.8 v80.82,115.56 | U$5.GND 61.26,78.04 62.68,76.62 62.68,74.84 61.26,73.42 61.26,73.06 U$5.GND2 60.73,72.53 52.37,64.17 52.37,43.02 R3.1 52.02,42.48 52.02,39.28 R4.1 52.19,38.57 52.19,35.55 R5.1 52.02,34.84 52.02,31.64 R6.1 52.02,31.1 52.02,27.9 R7.1 52.02,27.19 52.02,23.99 R8.1 52.02,23.46 52.02,19.72 R9.1 52.37,19.19 53.79,17.77 71.93,17.77 72.82,18.66 73.35,19.01 | B2.GND@2 78.86,96 78.86,98.31 B2.GND@3 | v82.06,92.62 82.06,73.42 84.37,71.11 84.55,71.11 85.09,70.57 J2.10 | B2.GND@0 73.88,42.66 73.88,44.97 B2.GND@1 74.42,45.33 v87.22,58.13 | 73.35,19.01 76.91,19.01 78.15,17.77 80.82,17.77 81.53,18.48 | 81.53,18.48 81.53,23.28 80.74,24.07 | 80.74,24.07 80.73,24.08 81.53,24.88 v81.53,26.84 | 73.35,19.01 IC1.8 | LED4.C 130.96,47.46 135.78,42.63 135.91,42.63 | 127.03,27.56 129.84,24.75 X3.2 | 127.03,27.56 126.34,28.26 122.07,28.26 B2.GND@4 121.54,27.9 114.6,20.97 114.6,18.12 | 114.6,18.12 114.6,13.32 X4.2 | 127.03,27.56 134.13,34.66 135.66,34.66 C5.2 C9.2 C10.2 C6.2 135.91,42.63 | J6.6 123.49,132.8 125.8,132.8 J6.8 126.34,132.8 128.29,132.8 J6.10 128.82,132.27 139.14,121.96 139.14,118.05 140.38,116.8 146.96,116.8 148.38,118.22 JP1.1 JP1.2 JP1.3 JP1.4 JP1.5 JP1.6 JP1.7 JP1.8 JP1.9
  Top 1.27: 135.05,74.84 133.63,73.42 133.63,73.06 U$7.GND2 | 135.05,74.84 135.05,76.62 133.63,78.04 U$7.GND 133.63,78.58 133.63,84.44 U$4.GND 133.98,84.98 135.05,86.04 135.05,87.64 | 135.05,87.64 133.63,89.07 133.63,89.42 U$4.GND2 | 161.36,49.24 158.7,49.24 158.16,49.77 151.76,49.77 150.16,48.17 150.16,47.64 U$19.GND | 161.36,49.24 LED3.C | 161.36,49.24 161.72,49.77 161.72,60.26 167.76,66.31 167.76,66.66 U$7.GNDMOT-1 167.41,67.2 165.1,69.51 165.1,74.49 | 165.1,74.49 165.1,93.15 167.76,95.82 U$4.GNDMOT-1 | 165.1,74.49 135.58,74.49 135.05,74.84 | 114.6,18.12 82.06,18.12 81.53,18.48 | IC3.2 138.58,45.3 135.91,42.63 | J1.1 135.66,88.25 135.05,87.64 | 80.74,24.07 79.47,24.07 IC1.13
  Bottom 1.27: v29.61,86.04 29.61,93.15 26.95,95.82 U$6.GNDMOT-1 | U$6.GND 61.26,107.38 63.57,109.69 68.73,109.69 R11.2 68.55,110.4 68.55,116.98 | 68.55,116.98 63.04,122.49 U$18.GND | U$5.GND 61.08,78.22 61.08,82.13 59.31,83.91 59.31,100.44 61.08,102.22 U$6.GND2 | J9.12 71.75,120 69.08,117.34 68.55,116.98 | v80.82,115.56 87.4,115.56 88.29,116.45 88.29,116.62 89,117.34 J7.9 | v82.06,92.62 78.86,95.82 B2.GND@2 | v81.53,26.84 81.53,34.84 73.88,42.48 B2.GND@0 | v87.22,58.13 84.91,58.13 83.31,59.73 83.31,68.62 85.09,70.4 J2.10 | JP1.1 148.74,115.02 167.76,96 U$4.GNDMOT-1 | U$19.GND 150.16,47.64 147.49,50.3 140.38,50.3 138.58,48.5 IC3.2
INA1
  Top 0.508: B2.22 121,94.4 122.6,94.4 124.91,96.71 124.91,100.27 131.85,107.2 133.45,107.2 U$4.INA
INA2
  Bottom 0.508: U$5.INA 61.26,55.11 68.2,55.11 72.82,50.48 104.11,50.48 124.91,71.29 124.91,97.6 122.6,99.91 121,99.91 119.58,98.49 B2.23
INA3
  Bottom 0.508: U$6.INA 61.26,84.44 72.28,73.42 79.22,73.42 95.93,90.13 111.22,90.13 116.91,95.82 B2.24
INA-ROLLER
  Bottom 0.508: U$7.INA 133.45,55.28 133.45,56.17 125.98,63.64 125.98,97.6 122.96,100.62 119.22,100.62 117.09,98.49 B2.25
KICK  (via drill 0.51)
  Top 0.508: J1.3 150.01,90.79 147.47,93.33 v129.69,93.33 | v126.28,98.81 125.73,98.26 125.73,92.74 122.74,89.75 120.57,89.75 B2.26
  Bottom 0.508: v129.69,93.33 126.79,96.23 126.79,97.94 126.28,98.45 v126.28,98.81
LED1
  Top 0.508: D1.A 61.44,42.48 61.44,41.26 70,32.7 70,29.83 71.9,27.93 IC1.1
LED2
  Top 0.508: D3.A 62.63,38.72 68.98,32.37 68.98,29.58 71.9,26.66 IC1.2
LED3
  Top 0.508: IC1.3 73.17,25.41 73.15,25.39 71.9,25.39 67.97,29.32 67.97,31.86 64.92,34.91 D6.A
LED4
  Top 0.508: IC1.4 71.78,24.12 66.82,29.07 66.82,30.59 66.32,31.1 D7.A
LED5
  Top 0.508: IC1.5 71.65,22.85 67.2,27.29 D8.A
LED6
  Top 0.508: D9.A 69.74,23.48 71.65,21.58 IC1.6
LED7
  Top 0.508: D10.A 68.09,19.67 68.73,20.31 IC1.7
MISO  (via drill 0.51)
  Top 0.508: v108.73,108.8 86.15,108.8 76.73,99.38 76.73,94.93 77.97,93.69 81.35,93.69 83.49,95.82 83.84,95.82 B2.50 | v116.38,116.45 116.38,128.36 118.16,130.14 J6.1
  Bottom 0.508: v116.38,116.45 v108.73,108.8
MOSI
  Bottom 0.508: B2.51 84.02,98.49 84.55,98.49 92.91,106.85 116.56,106.85 129.89,120.18 129.89,133.34 129,134.23 122.25,134.23 120.82,132.8 J6.4
MOTA1  (via drill 0.51)
  Top 1.27: v111.76,125.51 111.76,119.47 109.8,117.51 109.44,117.51 J7.1 | v120.65,114.31 136.47,114.31 149.81,100.98 167.76,100.98 U$4.INMOT1
  Bottom 1.27: v111.76,125.51 120.65,116.62 v120.65,114.31
MOTA2  (via drill 0.51)
  Top 1.27: v103.4,122.14 87.58,122.14 85.62,124.09 75.31,124.09 v66.77,115.56 | v60.37,109.16 60.02,109.16 31.39,80.53 31.39,66.13 26.95,61.68 U$5.INMOT1
  Bottom 1.27: v103.4,122.14 110.16,122.14 111.4,120.89 111.4,114.85 110.51,113.96 97.35,113.96 94.69,116.62 94.69,116.8 94.15,117.34 J7.7 | v60.37,109.16 v66.77,115.56
MOTA3
  Top 1.27: J9.1 109.27,120 109.27,121.25 102.69,127.83 68.02,127.83 64.46,131.38 61.62,131.38 29.61,99.38 29.61,93.51 26.95,90.84 U$6.INMOT1
MOTB1
  Top 1.27: J7.2 106.96,117.34 106.96,116.09 109.09,113.96 117.8,113.96 119.93,116.09 137.18,116.09 147.32,105.96 167.76,105.96 U$4.INMOT2
MOTB2  (via drill 0.51)
  Top 1.27: v79.22,109.69 73.88,109.69 71.57,107.38 70.15,107.38 v68.2,105.42 | v65.17,86.58 65.17,85.86 35.84,56.53 26.95,56.53 U$5.INMOT2
  Bottom 1.27: v79.22,109.69 88.82,109.69 92.38,113.25 92.38,114.67 91.66,115.38 91.66,117.34 J7.8 | v68.2,105.42 68.2,104.18 65.17,101.16 v65.17,86.58
MOTB3
  Top 1.27: J9.2 106.78,120 106.78,121.25 101.98,126.05 67.31,126.05 63.75,129.6 62.33,129.6 31.39,98.67 31.39,90.31 26.95,85.86 U$6.INMOT2
N$1
  Top 0.508: LED3.A 161.54,46.22 165.1,46.22 R14.2
N$2
  Top 0.508: D1.C 58.24,42.66 55.04,42.66 R3.2
N$3
  Top 0.508: D3.C 58.24,38.75 55.04,38.75 R4.2
N$4
  Top 0.508: D6.C 58.24,35.01 55.04,35.01 R5.2
N$5
  Top 0.508: R6.2 D7.C
N$6
  Top 0.508: D8.C 58.24,27.37 55.04,27.37 R7.2
N$7
  Top 0.508: D9.C 58.24,23.63 55.04,23.63 R8.2
N$8
  Top 0.508: D10.C 58.24,19.72 55.04,19.72 R9.2
N$21
  Top 0.508: 130.96,51.73 LED4.A | 128.47,51.73 R13.2
  Top 0.762: 128.47,51.73 130.96,51.73
P1
  Top 0.508: B2.A0 73.88,52.79 80.29,52.79 87.75,60.26 J2.1
P2
  Bottom 0.508: B2.A1 73.88,55.28 87.4,55.28 90.24,58.13 90.24,60.44 87.93,62.75 J2.3
P3  (via drill 0.51)
  Top 0.508: v89.18,58.48 89.18,64 J2.5
  Bottom 0.508: B2.A2 83.66,57.77 84.55,56.88 87.58,56.88 v89.18,58.48
P4
  Bottom 0.508: J2.7 90.06,70.22 90.06,73.95 88.64,75.37 82.24,75.37 79.57,72.71 74.06,72.71 72.28,70.93 72.28,62.4 73.71,60.97 73.71,60.44 B2.A3
P5
  Bottom 0.508: B2.A4 73.88,62.93 73.88,63.46 76.73,66.31 76.73,68.8 82.6,74.66 88.29,74.66 89.35,73.6 89.35,72 87.93,70.57 J2.9
P6
  Top 0.508: J2.2 85.09,60.44 78.69,60.44 73.88,65.24 B2.A5
PC1
  Top 0.508: J2.4 85.09,62.93 78.86,62.93 73.88,67.91 B2.A6
PC2
  Top 0.508: J2.6 85.09,65.42 84.55,65.42 79.57,70.4 73.88,70.4 B2.A7
PC3
  Top 0.508: J2.8 80.82,72.35 80.82,83.38 73.88,90.31 73.88,90.67 B2.A14
PIXY_SS  (via drill 0.51)
  Top 0.508: v117.62,109.33 114.78,106.49 89.53,106.49 81.53,98.49 B2.53
  Bottom 0.508: v117.62,109.33 125.8,117.51 125.8,130.14 J6.7
PWM1
  Top 0.508: U$4.PWM 133.45,102.22 133.45,101.33 128.32,96.2 128.32,66.69 122.07,60.44 B2.2
PWM2  (via drill 0.51)
  Top 0.508: v65.35,56.17 65.35,41.24 73.17,33.41 81.17,33.41 105.53,57.77 B2.3
  Bottom 0.508: v65.35,56.17 61.26,60.26 U$5.PWM
PWM3  (via drill 0.51)
  Top 0.508: v72.11,77.69 72.11,52.26 v74.95,49.42
  Bottom 0.508: v72.11,77.69 61.26,88.53 61.26,89.42 U$6.PWM | v74.95,49.42 116.38,49.42 122.07,55.11 B2.4
PWM-ROLLER
  Top 0.508: U$7.PWM 133.45,60.26 129.54,60.26 122.07,52.79 B2.5
ROLLERA  (via drill 0.51)
  Top 1.27: v169.19,51.55 167.76,51.55 165.1,54.22 165.1,58.84 167.76,61.51 U$7.INMOT1
  Bottom 1.27: v169.19,51.55 171.85,54.22 171.85,109.69 arc90 167.89,113.65 166.52,113.65 arc-90 160.17,120 160.17,122.54 arc90 156.36,126.35 155.09,126.35 arc-90 151.28,130.16 151.28,140.32 arc90 149.55,142.05 142.21,142.05 123.49,142.05 117.62,136.18 109.98,136.18 94.15,120.36 94.15,120 J9.7
ROLLERB  (via drill 0.51)
  Top 1.27: v104.82,133.52 116.2,133.52 124.94,142.25 150.62,142.25 arc-90 152.55,140.32 152.55,128.89 arc90 155.09,126.35 156.36,126.35 arc-90 160.17,122.54 160.17,117.46 arc90 163.98,113.65 166.8,113.65 arc-90 172.23,108.22 172.23,55.84 169.72,53.33 168.47,53.33 167.23,54.57 167.23,55.99 167.76,56.53 U$7.INMOT2
  Bottom 1.27: v104.82,133.52 91.66,120.36 91.66,120 J9.8
RX1  (via drill 0.51)
  Top 0.508: v71.04,76.26 67.48,79.82 67.48,94.58 66.77,95.29 66.77,113.6 63.04,117.34 U$18.RX | v95.93,91.2 115.31,91.2 115.85,90.67 115.85,84.44 117.09,83.2 122.07,83.2 B2.19
  Bottom 0.508: v71.04,76.26 73.17,74.13 78.86,74.13 v95.93,91.2
SCK  (via drill 0.51)
  Top 0.508: v113.71,112.36 109.09,107.73 86.15,107.73 77.44,99.02 77.44,95.29 78.33,94.4 79.4,94.4 80.82,95.82 81.35,95.82 B2.52 | v117.62,116.27 117.62,127.11 120.65,130.14 J6.3
  Bottom 0.508: v117.62,116.27 v113.71,112.36
SCL  (via drill 0.51)
  Top 0.508: JP3.1 143.76,139.03 143.76,136.72 JP3.2 143.76,136.36 143.76,134.05 JP3.3 143.76,133.87 143.76,131.56 JP3.4 143.76,131.2 143.76,129.07 JP3.5 143.76,128.89 143.76,126.58 JP3.6 143.76,126.23 143.76,123.91 JP3.7 143.76,123.74 143.76,121.42 JP3.8 143.76,121.25 143.76,118.76 JP3.9 | R19.1 117.27,89.42 118.46,89.42 119.63,88.25 B2.21 125.07,88.25 127.61,90.79 127.61,101.54 v132.2,106.13
  Bottom 0.508: J6.5 123.31,130.14 122.78,130.14 121.36,128.71 117.62,128.71 116.73,129.6 116.73,133.34 124.02,140.63 142.16,140.63 143.58,139.2 JP3.1 | v132.2,106.13 132.2,108.8 140.56,117.16 142.16,117.16 143.58,118.58 JP3.9
SDA  (via drill 0.51)
  Top 0.508: JP2.1 146.25,139.03 146.25,136.72 JP2.2 146.25,136.36 146.25,134.05 JP2.3 146.25,133.87 146.25,131.56 JP2.4 146.25,131.2 146.25,129.07 JP2.5 146.25,128.89 146.25,126.58 JP2.6 146.25,126.23 146.25,123.91 JP2.7 146.25,123.74 146.25,121.42 JP2.8 146.25,121.25 146.25,118.76 JP2.9 | R18.1 117.27,85.69 122.07,85.69 B2.20 | v140.2,115.38 128.47,127.11 128.47,130.14 J6.9 | v123.85,97.24 123.85,101.54 134.13,111.82 v136.65,111.82
  Bottom 0.508: JP2.9 146.07,118.58 142.87,115.38 v140.2,115.38 v136.65,111.82 | B2.20 122.07,86.22 124.2,88.35 124.2,96.89 v123.85,97.24
TX1
  Bottom 0.508: U$18.TX 62.86,120 62.86,119.11 58.06,114.31 58.06,66.66 60.55,64.17 61.44,64.17 72.28,53.33 72.28,52.08 73.17,51.19 87.04,51.19 116.38,80.53 122.07,80.53 B2.18
VMOT
  Top 1.27: U$4.VMOT-1 167.76,90.84 167.23,90.31 167.23,72.35 167.76,71.82 U$7.VMOT-1
  Bottom 1.27: 29.38,74.26 31.39,76.26 31.39,96.36 26.95,100.8 U$6.VMOT-1 | 29.38,74.26 26.95,71.82 U$5.VMOT-1 | 156.74,71.82 131.26,46.34 131.26,36.49 138.58,29.17 140.51,29.17 arc-90 141.12,28.56 141.12,15.86 arc-90 133.5,8.24 125.88,8.24 arc-90 125.85,8.27 X4.1 114.19,8.52 94.33,8.52 arc-90 29.38,73.47 29.38,74.26 | 156.74,71.82 167.76,71.82 U$7.VMOT-1 | J1.2 147.47,81.09 156.74,71.82

### Text on the board
tPlace: Made by Matteo Luziatelli V1 / @luziato 2019